# Altium schematic sheet DebugInterface.SchDoc
size A4; SheetNumber: 4; SheetTotal: 10
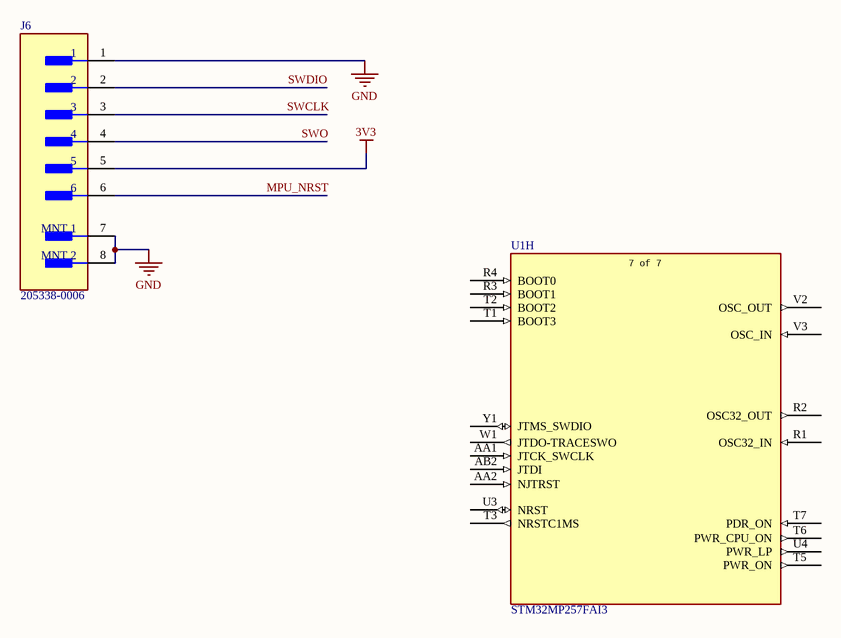
[diagram p0: DebugInterface.SchDoc]

## Parts
J6  205338-0006  [FP-2053380006-MFG]
U1  STM32MP257FAI3  [TFBGA436_STM]  (part H of 8)

## Nets
3V3: J6.5
GND: J6.1 J6.7(MNT_1) J6.8(MNT_2)
MPU_NRST: J6.6
SWCLK: J6.3
SWDIO: J6.2
SWO: J6.4

Not connected (* = marked no-connect by the designer): U1 AA1(JTCK_SWCLK) AA2(NJTRST) AB2(JTDI) R1(OSC32_IN) R2(OSC32_OUT) R3(BOOT1) R4(BOOT0) T1(BOOT3) T2(BOOT2) T3(NRSTC1MS) T5(PWR_ON) T6(PWR_CPU_ON) T7(PDR_ON) U3(NRST) U4(PWR_LP) V2(OSC_OUT) V3(OSC_IN) W1(JTDO-TRACESWO) Y1(JTMS_SWDIO)

## Notes on the sheet
- (in symbol STM32MP257FAI3, part H) 7 of 7

## Library data of the parts
J6 = CMP-00257-108204701-1: 205338-0006 Connector Shrouded Header Positive Lock 6 Position 2mm Pitch Right Angle Surface Mount T/R; Manufacturer Lifecycle Status: ACTIVE; Number of Circuits: 6; Gender: Male; NexarPartId: 108204701; Contact Plating: Gold; Lifecycle Status: Production; Schedule B: 8536694040; RoHS: Compliant; Number of Rows: 1; Country of Origin: MY; Orientation: Right Angle
U1 = STM32MP257FAI3: MPU with Dual Arm Cortex-A35 @1.5GHz, Cortex-M33 @400MHz, 3xEthernet (2+1 switch), 3xFD-CAN, LVDS/DSI, H.264, 3D GPU, AI/NN, Secure Boot, Cryptography, DRAM enc/dec, PKA; Manufacturer_Name: STMicroelectronics; Copyright: Copyright (C) 2025 Ultra Librarian. All rights reserved.; Manufacturer_Part_Number: STM32MP257FAI3; RefDes: RefDes; Type: Type